# EAGLE design simpleArm-1 (EAGLE 9.5.2)
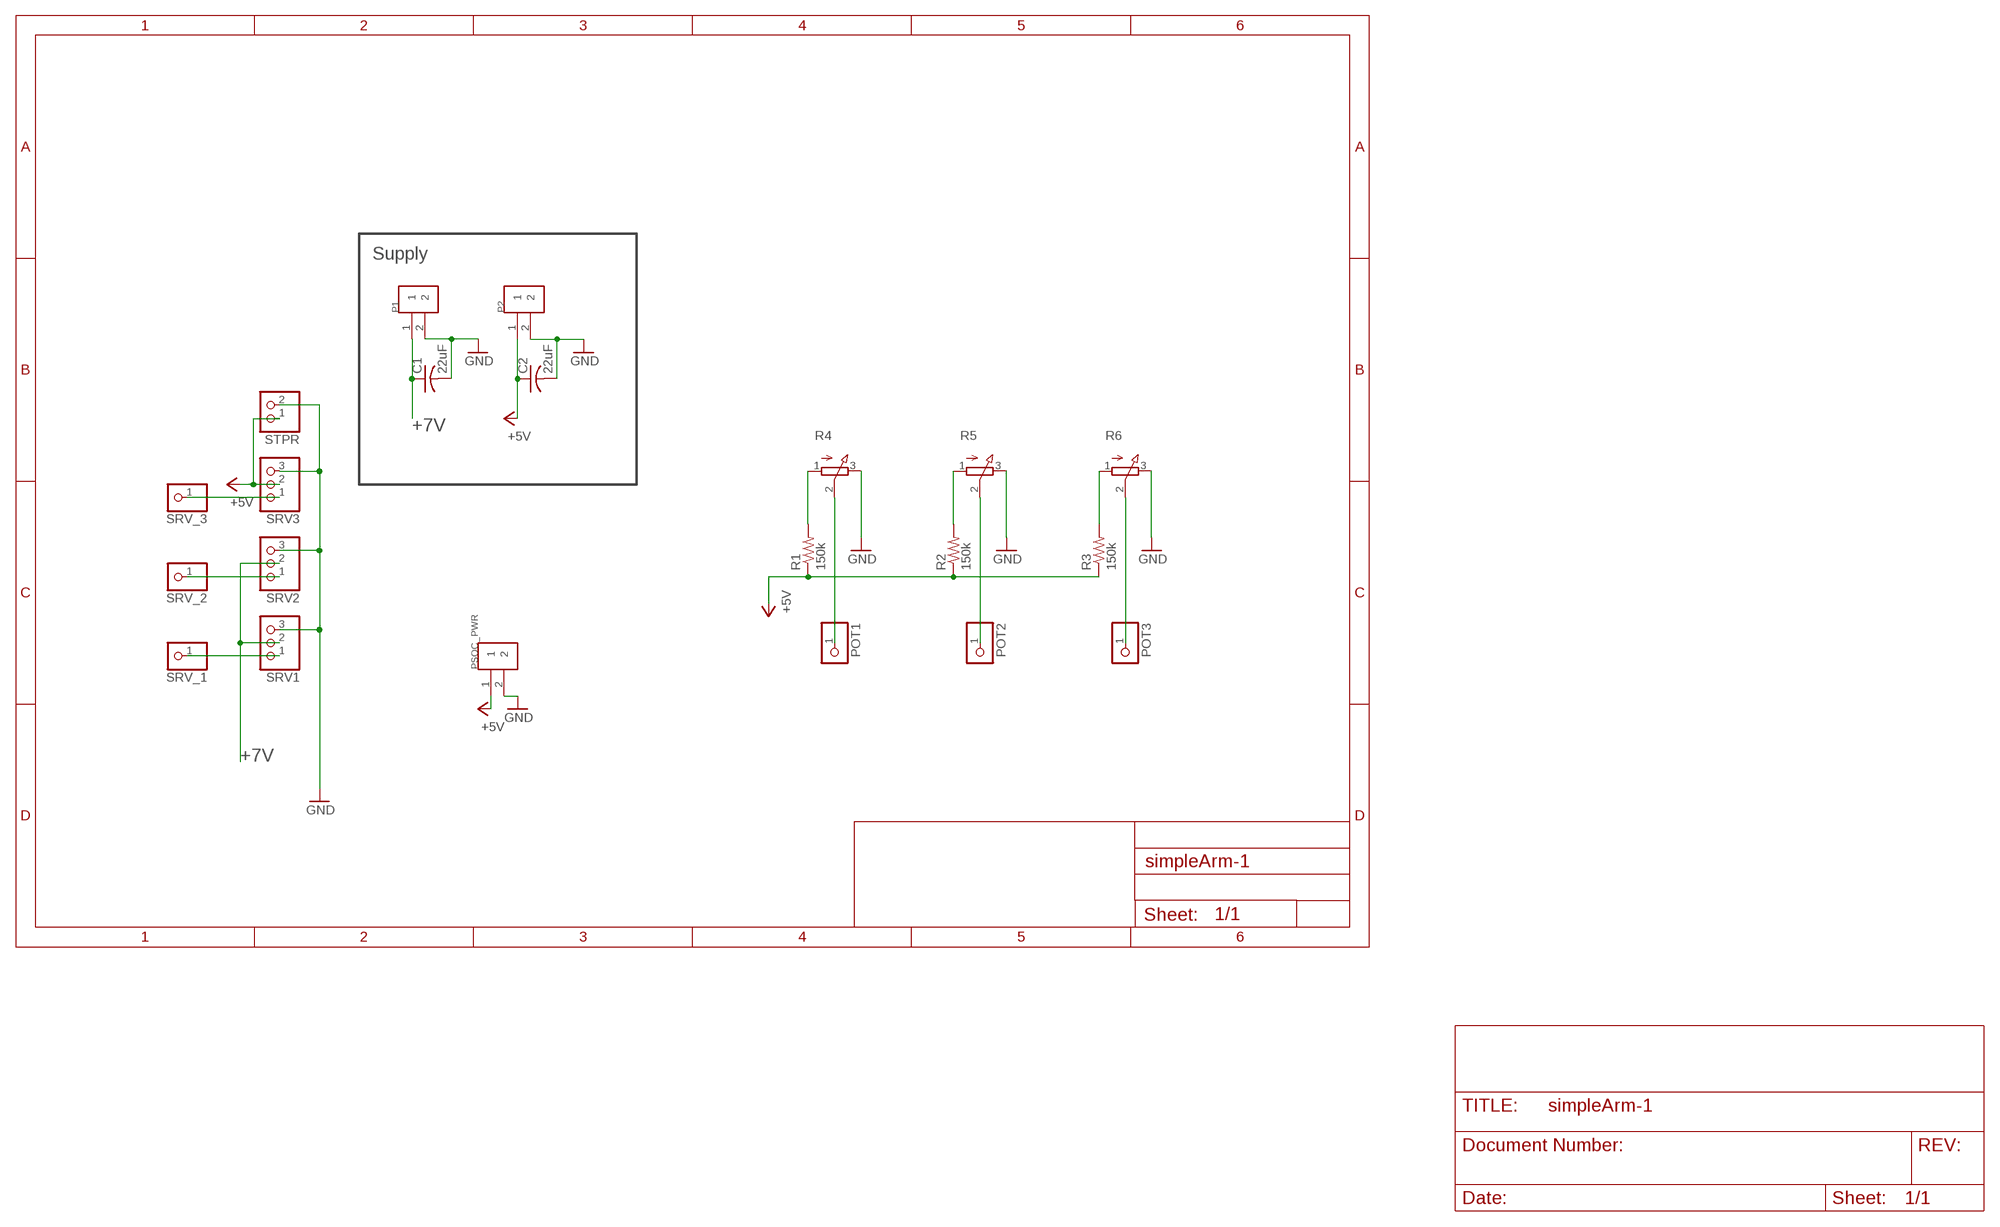
[diagram p0: schematic, sheet 1]

## Parts
C1  22uF  C-US050-030X075  [C050-030X075]
C2  22uF  C-US050-030X075  [C050-030X075]
P1  282837-2  [TE_282837-2]
P2  282837-2  [TE_282837-2]
POT1  PINHD-1X1  [1X01]
POT2  PINHD-1X1  [1X01]
POT3  PINHD-1X1  [1X01]
PSOC_PWR  282837-2  [TE_282837-2]
R1  150k  R-US_0204/7  [0204/7]
R2  150k  R-US_0204/7  [0204/7]
R3  150k  R-US_0204/7  [0204/7]
R4  3RP/1610N  [3RP/1610N]
R5  3RP/1610N  [3RP/1610N]
R6  3RP/1610N  [3RP/1610N]
SRV1  PINHD-1X3  [1X03]
SRV2  PINHD-1X3  [1X03]
SRV3  PINHD-1X3  [1X03]
SRV_1  PINHD-1X1  [1X01]
SRV_2  PINHD-1X1  [1X01]
SRV_3  PINHD-1X1  [1X01]
STPR  PINHD-1X2  [1X02]

## Nets
+5V [VCC]: C2.1 P2.1 PSOC_PWR.1 R1.1 R2.1 R3.1 SRV3.2 STPR.1
+7V [VCC]: C1.1 P1.1 SRV1.2 SRV2.2
GND [VCC]: C1.2 C2.2 P1.2 P2.2 PSOC_PWR.2 R4.3(E) R5.3(E) R6.3(E) SRV1.3 SRV2.3 SRV3.3 STPR.2
N$1: R1.2 R4.1(A)
N$2: R2.2 R5.1(A)
N$3: R3.2 R6.1(A)
N$4: POT3.1 R6.2(S)
N$5: POT1.1 R4.2(S)
N$6: POT2.1 R5.2(S)
N$7: SRV3.1 SRV_3.1
N$8: SRV2.1 SRV_2.1
N$9: SRV1.1 SRV_1.1

## Notes on the sheet
- Supply

## Library data of the parts
C1 C2 = resistor:C-US: CAPACITOR, American symbol
P1 P2 PSOC_PWR = 282837-2:282837-2: TERM BLOCK 5.08MM 2POS SIDE ENTY; AVAILABILITY: Unavailable; COMMENT: 282837-2; DESCRIPTION: Connector Terminal Blocks Receptacle 2 Position 5.08mm Solder Straight Thru-Hole 13.5A/Contact; MF: TE Connectivity; MP: 282837-2; PACKAGE: None; PRICE: None; TE_PURCHASE_URL: https://www.te.com/usa-en/product-282837-2.html?te_bu=Cor&te_type=disp&te_campaign=seda_glo_cor-seda-global-disp-prtnr-fy19-seda-model-bom-cta_sma-317_1&elqCampaignId=32493
POT1-POT3 SRV_1-SRV_3 = pinhead:PINHD-1X1: PIN HEADER
R1-R3 = resistor:R-US_: RESISTOR, American symbol
R4-R6 = pot:3RP/1610N: 16mm Potentiometer one level Source: http://www.alphapotentiometers.net/html/16mm_pot_2.html
SRV1-SRV3 = pinhead:PINHD-1X3: PIN HEADER
STPR = pinhead:PINHD-1X2: PIN HEADER

## Net classes
0 default: width 0.381 mm, clearance 0.254 mm
2 VCC: width 1.651 mm, clearance 0.381 mm to class 0, clearance 0.381 mm

## Board
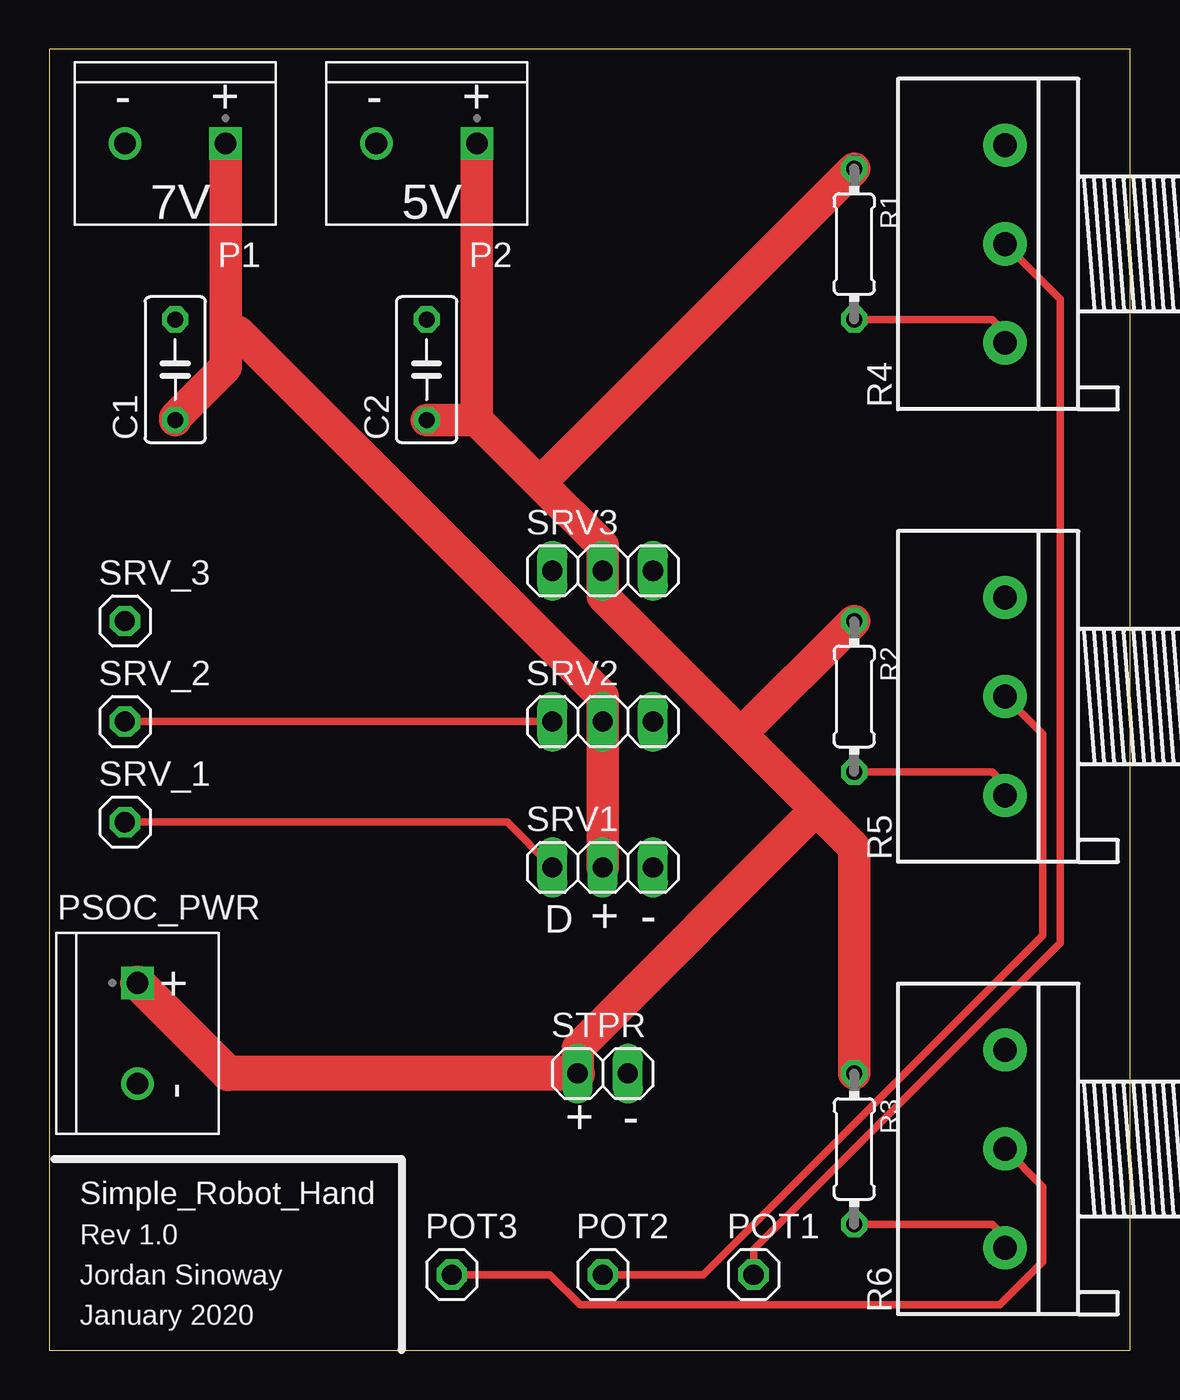
[diagram p1: board, top side]
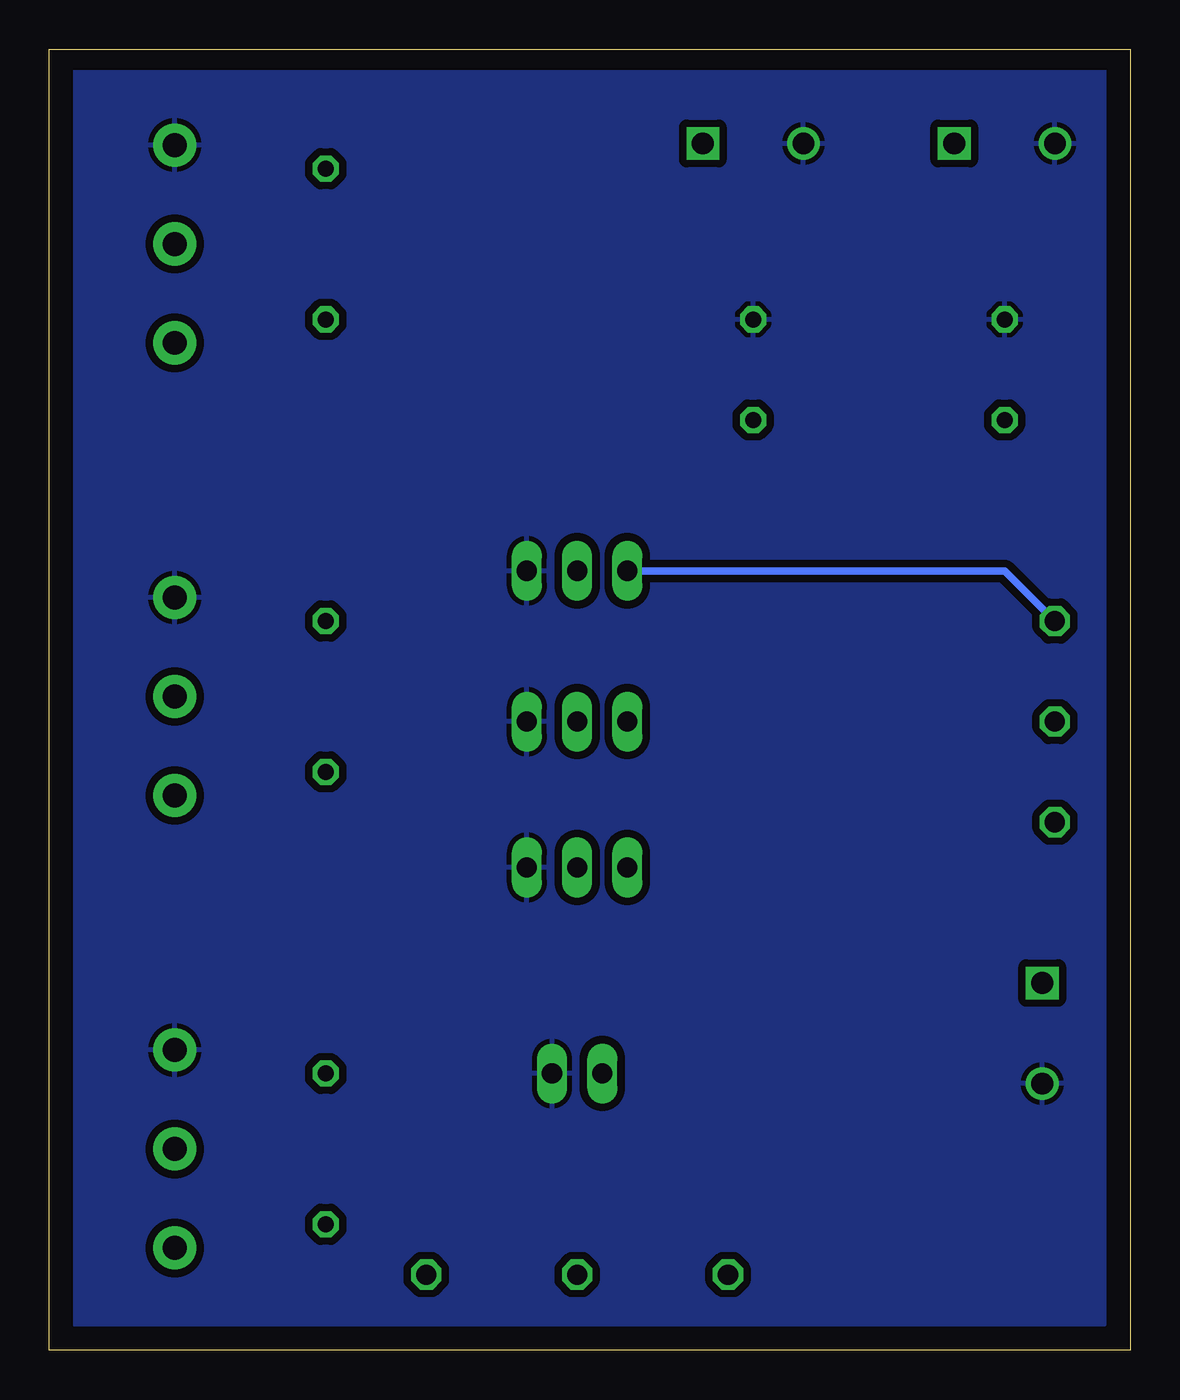
[diagram p2: board, bottom side, seen from below]

Size 54.59 x 65.71 mm. Coordinates in mm from the lower left corner, seen from the top.
Outline: 0,0 54.59,0 54.59,65.71 0,65.71 0,0
Copper layers (1*16): Top 0.035mm / dielectric 1.5mm / Bottom 0.035mm
Design rules "default": minimum track width 6mil, minimum drill 0.35mm, track to track 6mil, track to pad 6mil, pad to pad 6mil, via to via 6mil, smd to smd 6mil, copper to edge 40mil, drill to drill 6mil, minimum pad ring 10mil, minimum via ring 8mil, stop-mask expansion 4mil, vias tented up to drill 0mil, thermal gap 10mil

### Footprints (pad centres in the part's own frame; a part is rotated, then mirrored left to right if it is on the bottom)
C050-030X075 = drill 0.813 octagon: 1 -2.54,0; 2 2.54,0
TE_282837-2 = drill 1.1 square: 1 -2.54,0 | drill 1.1: 2 2.54,0
1X01 = drill 1.016 octagon: 1 0,0
0204/7 = drill 0.813 octagon: 1 -3.81,0; 2 3.81,0
3RP/1610N = drill 1.2 pad 2.184: 1 -5,0; 2 0,0; 3 5,0
1X03 = drill 1.016 long: 1 -2.54,0; 2 0,0; 3 2.54,0
1X02 = drill 1.016 long: 1 -1.27,0; 2 1.27,0

### Placement (x,y rotation side)
C1  6.35,49.53 90 top
C2  19.05,49.53 90 top
P1  6.35,60.96 180 top
P2  19.05,60.96 180 top
POT1  35.56,3.81 0 top
POT2  27.94,3.81 0 top
POT3  20.32,3.81 0 top
PSOC_PWR  4.45,16 270 top
R1  40.64,55.88 270 top
R2  40.64,33.02 270 top
R3  40.64,10.16 270 top
R4  48.26,55.88 90 top
R5  48.26,33.02 90 top
R6  48.26,10.16 90 top
SRV1  27.94,24.38 0 top
SRV2  27.94,31.75 0 top
SRV3  27.94,39.37 0 top
SRV_1  3.81,26.67 0 top
SRV_2  3.81,31.75 0 top
SRV_3  3.81,36.83 0 top
STPR  27.94,13.97 0 top

### Tracks (layer width: path | path; a pad name or v marks a point on that pad's centre or on a via)
+5V
  Top 1.651: R3.1 40.64,25.4 38.73,27.3 | 34.92,31.12 27.94,38.1 SRV3.2 27.94,40.64 24.77,43.81 | 34.92,31.12 38.73,27.3 | 21.59,46.99 C2.1 | 24.77,43.81 21.59,46.99 | 34.92,31.12 R2.1 | 24.77,43.81 R1.1 | STPR.1 26.67,15.24 38.73,27.3 | 21.59,46.99 P2.1
  Top 1.778: STPR.1 9.02,13.97 PSOC_PWR.1
+7V
  Top 1.651: SRV1.2 SRV2.2 27.94,33.02 9.53,51.44 8.89,51.44 | C1.1 6.35,47.12 8.89,49.66 8.89,51.44 | P1.1 8.89,51.44
GND
  pour Bottom: 1.27,64.77 53.34,64.77 53.34,1.27 1.27,1.27
N$1
  Top 0.381: R1.2 47.62,52.07 48.26,51.44 R4.1
N$2
  Top 0.381: R2.2 47.62,29.21 48.26,28.57 R5.1
N$3
  Top 0.381: R3.2 47.62,6.35 48.26,5.72 R6.1
N$4
  Top 0.381: POT3.1 25.27,3.81 26.8,2.29 48.01,2.29 50.16,4.45 50.16,8.25 R6.2
N$5
  Top 0.381: POT1.1 35.56,5.08 51.05,20.57 51.05,53.09 R4.2
N$6
  Top 0.381: POT2.1 33.02,3.81 50.16,20.96 50.16,31.12 R5.2
N$7
  Bottom 0.381: SRV_3.1 6.35,39.37 SRV3.1
N$8
  Top 0.381: SRV2.1 SRV_2.1
N$9
  Top 0.381: SRV_1.1 23.11,26.67 SRV1.1

### Text on the board
tNames: - | + | - | + | 7V | 5V | D | + | - | + | - | + | - | Simple_Robot_Hand | Rev 1.0 | Jordan Sinoway | January 2020